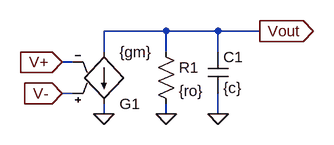
[diagram p0: schematic single_stage_opamp.asc]
single_stage_opamp.asc, the LTspice schematic file:
Version 4
SHEET 1 880 680
WIRE 208 96 112 96
WIRE 288 96 208 96
WIRE 352 96 288 96
WIRE 112 128 112 96
WIRE 208 128 208 96
WIRE 288 128 288 96
WIRE 64 144 48 144
WIRE 64 192 48 192
WIRE 112 224 112 208
WIRE 208 224 208 208
WIRE 288 224 288 192
FLAG 112 224 0
FLAG 208 224 0
FLAG 288 224 0
FLAG 48 144 V+
IOPIN 48 144 In
FLAG 48 192 V-
IOPIN 48 192 In
FLAG 352 96 Vout
IOPIN 352 96 Out
SYMBOL res 192 112 R0
SYMATTR InstName R1
SYMATTR Value {ro}
SYMBOL cap 272 128 R0
SYMATTR InstName C1
SYMATTR Value {c}
SYMBOL g 112 224 M180
SYMATTR InstName G1
SYMATTR Value {gm}

The netlist it stands for:
* single_stage_opamp.asc
R1 Vout 0 {ro}
C1 Vout 0 {c}
G1 Vout 0 V- V+ {gm}
.backanno
.end